# Altium schematic sheet OBC_EEPROM.SchDoc: EEPROM
size A4; SheetNumber: 10; SheetTotal: 10
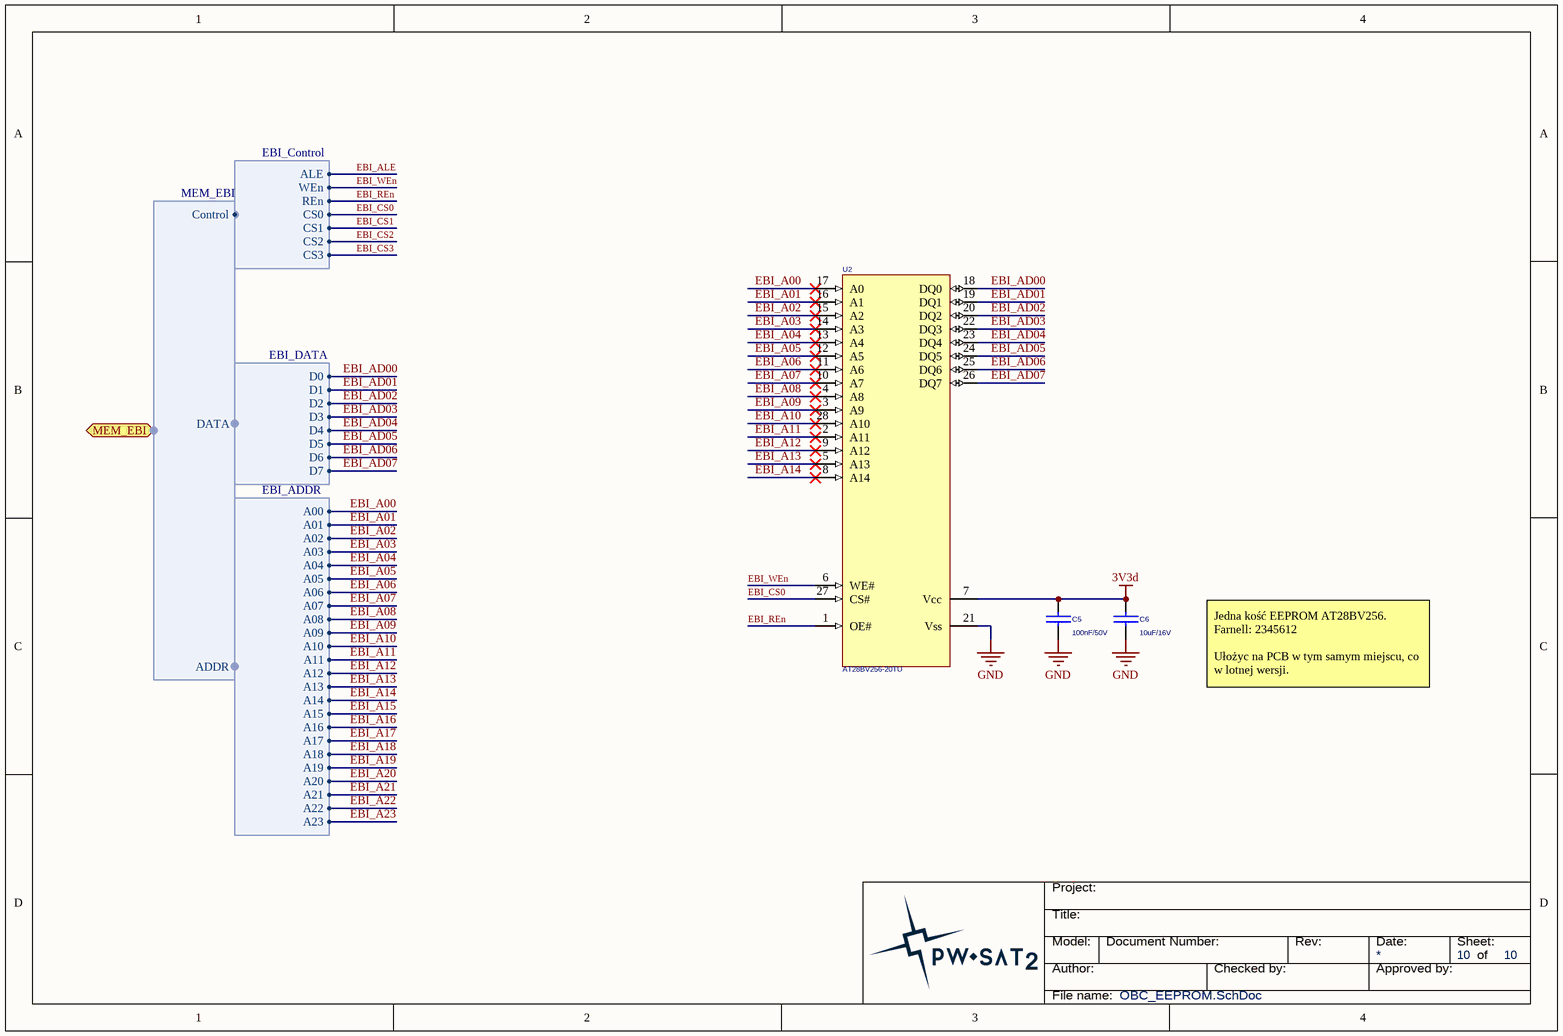
[diagram p0: OBC_EEPROM.SchDoc]

## Parts
C5  100nF/50V  [C0603]
C6  10uF/16V  [C1206]
U2  AT28BV256-20TU  [TSOP-28T]

## Ports
MEM_EBI (harness MEM_EBI)

## Harnesses
EBI_Control: ALE, WEn, REn, CS0, CS1, CS2, CS3
MEM_EBI: DATA, ADDR, Control
EBI_DATA: D6, D5, D4, D3, D2, D1, D0, D7
EBI_ADDR: A09, A10, A11, A12, A13, A14, A15, A08, A16, A17, A18, A19, A20, A21, A22, A23, A00, A01, A02, A03, A04, A05, A06, A07

## Nets
3V3d: C5.1 C6.1 U2.7(Vcc)
GND: C5.2 C6.2 U2.21(Vss)
EBI_A00: U2.17(A0) ; harness EBI_ADDR.A00
EBI_A01: U2.16(A1) ; harness EBI_ADDR.A01
EBI_A02: U2.15(A2) ; harness EBI_ADDR.A02
EBI_A03: U2.14(A3) ; harness EBI_ADDR.A03
EBI_A04: U2.13(A4) ; harness EBI_ADDR.A04
EBI_A05: U2.12(A5) ; harness EBI_ADDR.A05
EBI_A06: U2.11(A6) ; harness EBI_ADDR.A06
EBI_A07: U2.10(A7) ; harness EBI_ADDR.A07
EBI_A08: U2.4(A8) ; harness EBI_ADDR.A08
EBI_A09: U2.3(A9) ; harness EBI_ADDR.A09
EBI_A10: U2.28(A10) ; harness EBI_ADDR.A10
EBI_A11: U2.2(A11) ; harness EBI_ADDR.A11
EBI_A12: U2.9(A12) ; harness EBI_ADDR.A12
EBI_A13: U2.5(A13) ; harness EBI_ADDR.A13
EBI_A14: U2.8(A14) ; harness EBI_ADDR.A14
EBI_A15: harness EBI_ADDR.A15
EBI_A16: harness EBI_ADDR.A16
EBI_A17: harness EBI_ADDR.A17
EBI_A18: harness EBI_ADDR.A18
EBI_A19: harness EBI_ADDR.A19
EBI_A20: harness EBI_ADDR.A20
EBI_A21: harness EBI_ADDR.A21
EBI_A22: harness EBI_ADDR.A22
EBI_A23: harness EBI_ADDR.A23
EBI_AD00: U2.18(DQ0) ; harness EBI_DATA.D0
EBI_AD01: U2.19(DQ1) ; harness EBI_DATA.D1
EBI_AD02: U2.20(DQ2) ; harness EBI_DATA.D2
EBI_AD03: U2.22(DQ3) ; harness EBI_DATA.D3
EBI_AD04: U2.23(DQ4) ; harness EBI_DATA.D4
EBI_AD05: U2.24(DQ5) ; harness EBI_DATA.D5
EBI_AD06: U2.25(DQ6) ; harness EBI_DATA.D6
EBI_AD07: U2.26(DQ7) ; harness EBI_DATA.D7
EBI_ALE: harness EBI_Control.ALE
EBI_CS0: U2.27(CS#) ; harness EBI_Control.CS0
EBI_CS1: harness EBI_Control.CS1
EBI_CS2: harness EBI_Control.CS2
EBI_CS3: harness EBI_Control.CS3
EBI_REn: U2.1(OE#) ; harness EBI_Control.REn
EBI_WEn: U2.6(WE#) ; harness EBI_Control.WEn

## Notes on the sheet
- Jedna kość EEPROM AT28BV256.
  Farnell: 2345612
  Ułożyc na PCB w tym samym miejscu, co w lotnej wersji.
- Title:
- Project:
- Author:
- Model:
- Document Number:
- Checked by:
- Rev:
- Date:
- Approved by:
- Sheet:
- of
- File name:

## Library data of the parts
C5 = CAP: Capacitator; Voltage: 50V; Material: X7R; Value: 100nF; Farnell: 1759122; Supplier Part Number 1: 1759122; Supplier 1: Farnell
C6 = CAP: Capacitator; Voltage: 16V; Material: X5R; Value: 10uF; Farnell: 2320922; Supplier Part Number 1: 2320922; Supplier 1: Farnell
U2 = AT28BV256-20TU: 256K (32K x 8)  Battery-Voltage  Parallel  EEPROMs; Manufacturer: Microchip Technology; partNo: AT28BV256-20TU; DigiKey: AT28BV256-20TU-ND; Supplier 1: Digi-Key